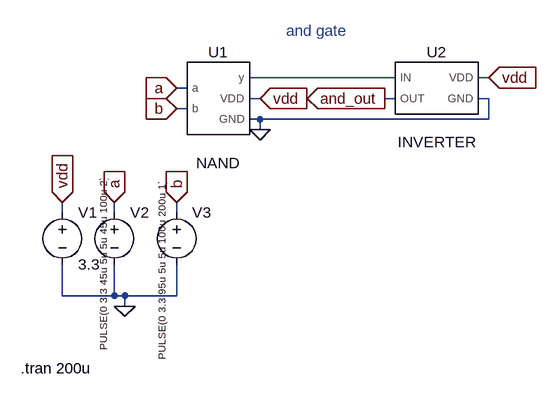
[diagram p0: schematic and1_raw.asc]
and1_raw.asc, the LTspice schematic file:
Version 4.1
SHEET 1 880 680
WIRE 368 96 144 96
WIRE 512 96 496 96
WIRE 48 112 32 112
WIRE 160 128 144 128
WIRE 368 128 352 128
WIRE 512 128 496 128
WIRE 48 144 32 144
WIRE 160 160 144 160
WIRE 512 160 512 128
WIRE 512 160 160 160
WIRE 160 176 160 160
WIRE -144 304 -144 288
WIRE -64 304 -64 288
WIRE 32 304 32 288
WIRE -144 432 -144 384
WIRE -64 432 -64 384
WIRE -64 432 -144 432
WIRE -48 432 -64 432
WIRE 32 432 32 384
WIRE 32 432 -48 432
WIRE -48 448 -48 432
FLAG 160 176 0
FLAG 160 128 vdd
IOPIN 160 128 In
FLAG 352 128 and_out
IOPIN 352 128 Out
FLAG 512 96 vdd
IOPIN 512 96 In
FLAG 32 112 a
IOPIN 32 112 In
FLAG 32 144 b
IOPIN 32 144 In
FLAG -48 448 0
FLAG -144 288 vdd
IOPIN -144 288 In
FLAG -64 288 a
IOPIN -64 288 In
FLAG 32 288 b
IOPIN 32 288 In
SYMBOL nand 96 128 R0
WINDOW 3 0 56 Invisible 2
WINDOW 38 0 84 Top 2
SYMATTR InstName U1
SYMATTR Value ""
SYMBOL inverter 432 112 R0
WINDOW 3 0 40 Invisible 2
WINDOW 38 0 68 Top 2
SYMATTR InstName U2
SYMATTR Value ""
SYMBOL voltage -144 288 R0
WINDOW 123 0 0 Left 0
WINDOW 39 0 0 Left 0
SYMATTR InstName V1
SYMATTR Value 3.3
SYMBOL voltage -64 288 R0
WINDOW 3 -17 228 VLeft 1
WINDOW 123 0 0 Left 0
WINDOW 39 0 0 Left 0
SYMATTR InstName V2
SYMATTR Value PULSE(0 3.3 45u 5u 5u 45u 100u 2)
SYMBOL voltage 32 288 R0
WINDOW 3 -23 243 VLeft 1
WINDOW 123 0 0 Left 0
WINDOW 39 0 0 Left 0
SYMATTR InstName V3
SYMATTR Value PULSE(0 3.3 95u 5u 5u 100u 200u 1)
TEXT 200 24 Left 2 ;and gate
TEXT -208 544 Left 2 !.tran 200u

The netlist it stands for:
* and1_raw.asc
X§U1 a b N001 vdd 0 NAND  ; pins a b y VDD GND
X§U2 N001 and_out vdd 0 INVERTER  ; pins IN OUT VDD GND
V1 vdd 0 3.3
V2 a 0 PULSE(0 3.3 45u 5u 5u 45u 100u 2)
V3 b 0 PULSE(0 3.3 95u 5u 5u 100u 200u 1)
* and gate
.tran 200u
.lib yap_cells.lib
.backanno
.end